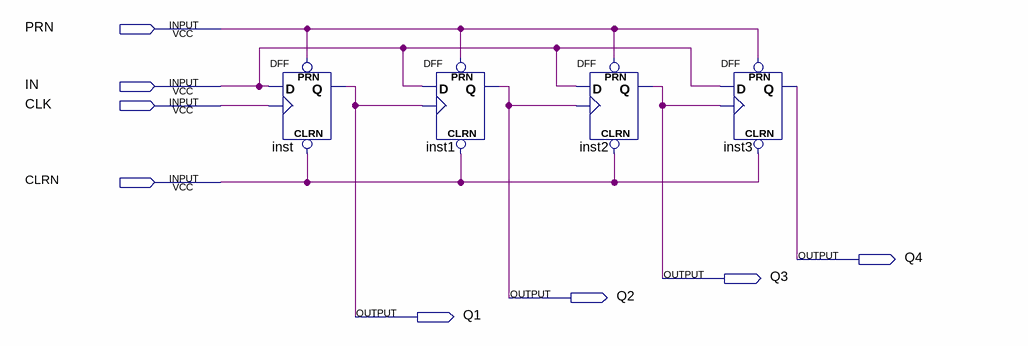
[diagram p0: schematic sheet]
// Quartus schematic lab10step1.bdf as structural Verilog: 4 symbols, 8 pins
module lab10step1 (
  input  PRN,
  input  IN,
  input  CLK,
  input  CLRN,
  output Q4,
  output Q3,
  output Q2,
  output Q1
);

  DFF inst (.CLRN(CLRN), .CLK(CLK), .D(IN), .PRN(PRN), .Q(Q1));
  DFF inst1 (.CLRN(CLRN), .CLK(Q1), .D(IN), .PRN(PRN), .Q(Q2));
  DFF inst2 (.CLRN(CLRN), .CLK(Q2), .D(IN), .PRN(PRN), .Q(Q3));
  DFF inst3 (.CLRN(CLRN), .CLK(Q3), .D(IN), .PRN(PRN), .Q(Q4));
endmodule
